# EAGLE design HAP-5xDimmer-3.1 (EAGLE 5.02)
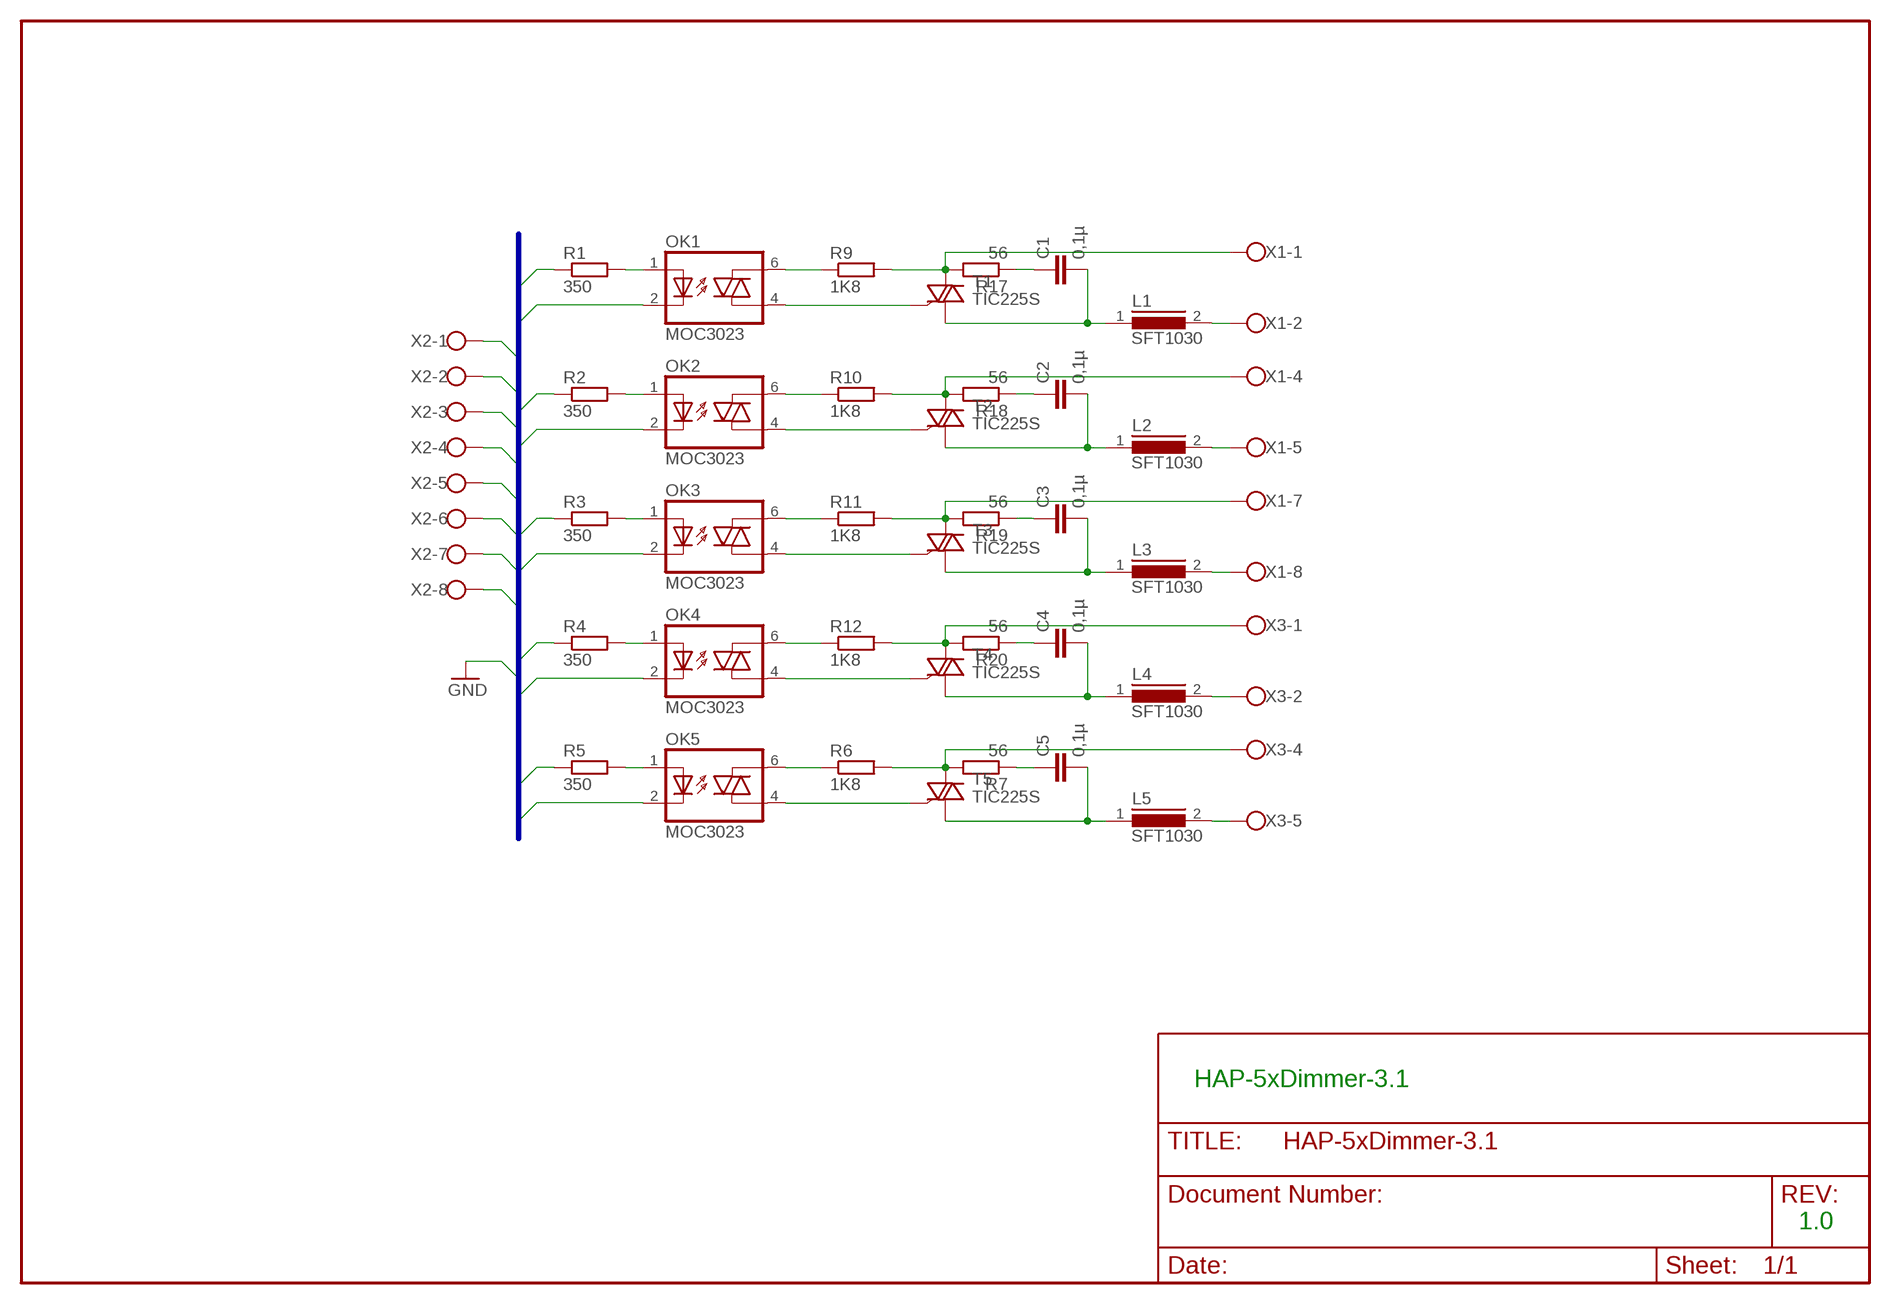
[diagram p0: schematic, sheet 1]

## Parts
C1  0,1µ  C15/8  [C15B8]
C2  0,1µ  C15/8  [C15B8]
C3  0,1µ  C15/8  [C15B8]
C4  0,1µ  C15/8  [C15B8]
C5  0,1µ  C15/8  [C15B8]
L1  SFT1030  [SFT1030]
L2  SFT1030  [SFT1030]
L3  SFT1030  [SFT1030]
L4  SFT1030  [SFT1030]
L5  SFT1030  [SFT1030]
OK1  MOC3023  IL420  [DIL06]
OK2  MOC3023  IL420  [DIL06]
OK3  MOC3023  IL420  [DIL06]
OK4  MOC3023  IL420  [DIL06]
OK5  MOC3023  IL420  [DIL06]
R1  350  R-EU_0204/7  [0204/7]
R2  350  R-EU_0204/7  [0204/7]
R3  350  R-EU_0204/7  [0204/7]
R4  350  R-EU_0204/7  [0204/7]
R5  350  R-EU_0204/7  [0204/7]
R6  1K8  R-EU_0411/3V  [0411V]
R7  56  R-EU_0411/3V  [0411V]
R9  1K8  R-EU_0411/3V  [0411V]
R10  1K8  R-EU_0411/3V  [0411V]
R11  1K8  R-EU_0411/3V  [0411V]
R12  1K8  R-EU_0411/3V  [0411V]
R17  56  R-EU_0411/3V  [0411V]
R18  56  R-EU_0411/3V  [0411V]
R19  56  R-EU_0411/3V  [0411V]
R20  56  R-EU_0411/3V  [0411V]
T1  TIC225S  [TO220DS]
T2  TIC225S  [TO220DS]
T3  TIC225S  [TO220DS]
T4  TIC225S  [TO220DS]
T5  TIC225S  [TO220DS]
X1  W237-08P  [W237-8P]
X2  W237-08P  [W237-8P]
X3  W237-08P  [W237-8P]

## Nets
D0: R1.1 X2.1
D1: R2.1 X2.2
D2: R3.1 X2.3
D3: R4.1 X2.4
D4: R5.1 X2.5
GND: OK1.2(C) OK2.2(C) OK3.2(C) OK4.2(C) OK5.2(C) X2.6 X2.7 X2.8
N$1 [Mains]: C1.2 L1.1 T1.A1
N$2 [Medium]: OK1.4(A1) T1.G
N$3 [Medium]: OK2.4(A1) T2.G
N$4: OK1.1(A) R1.2
N$5 [Medium]: C3.1 R19.1
N$6 [Mains]: L1.2 X1.2
N$7 [Mains]: R9.2 R17.2 T1.A2 X1.1
N$8: OK2.1(A) R2.2
N$9 [Mains]: R10.2 R18.2 T2.A2 X1.4
N$10: OK3.1(A) R3.2
N$11 [Mains]: R11.2 R19.2 T3.A2 X1.7
N$12: OK4.1(A) R4.2
N$13 [Mains]: R12.2 R20.2 T4.A2 X3.1
N$14 [Mains]: L2.2 X1.5
N$15 [Mains]: L3.2 X1.8
N$17 [Mains]: L4.2 X3.2
N$18 [Mains]: R6.2 R7.2 T5.A2 X3.4
N$19 [Mains]: L5.2 X3.5
N$20: OK5.1(A) R5.2
N$21 [Mains]: C2.2 L2.1 T2.A1
N$22 [Medium]: C5.1 R7.1
N$23 [Mains]: C3.2 L3.1 T3.A1
N$24 [Mains]: C5.2 L5.1 T5.A1
N$25 [Mains]: C4.2 L4.1 T4.A1
N$26 [Medium]: OK5.4(A1) T5.G
N$27 [Medium]: OK5.6(A2) R6.1
N$28 [Medium]: OK3.4(A1) T3.G
N$29 [Medium]: OK4.4(A1) T4.G
N$38 [Medium]: OK4.6(A2) R12.1
N$39 [Medium]: OK3.6(A2) R11.1
N$40 [Medium]: OK2.6(A2) R10.1
N$41 [Medium]: OK1.6(A2) R9.1
N$50 [Medium]: C1.1 R17.1
N$51 [Medium]: C2.1 R18.1
N$52 [Medium]: C4.1 R20.1
Unconnected: X1.3 X1.6 X3.3 X3.6 X3.7 X3.8

## Buses
D[0..7],GND

## Notes on the sheet
- HAP-5xDimmer-3.1
- 1.0

## Library data of the parts
C1-C5 = capacitor-wima:C: CAPACITOR naming: grid - package width
L1-L5 = inductors:SFT1030: INDUCTOR
OK1-OK5 = optocoupler:IL420: SIEMENS OPTO COUPLER
R1-R7 R9-R12 R17-R20 = rcl:R-EU_: RESISTOR, European symbol
T1-T5 = triac:TIC225S: TRIAC
X1-X3 = con-wago-508:W237-08P: WAGO SREW CLAMP

## Net classes
1 Mains: width 2.184 mm, clearance 0.508 mm
2 Medium: width 0.813 mm, clearance 0.508 mm

## Board
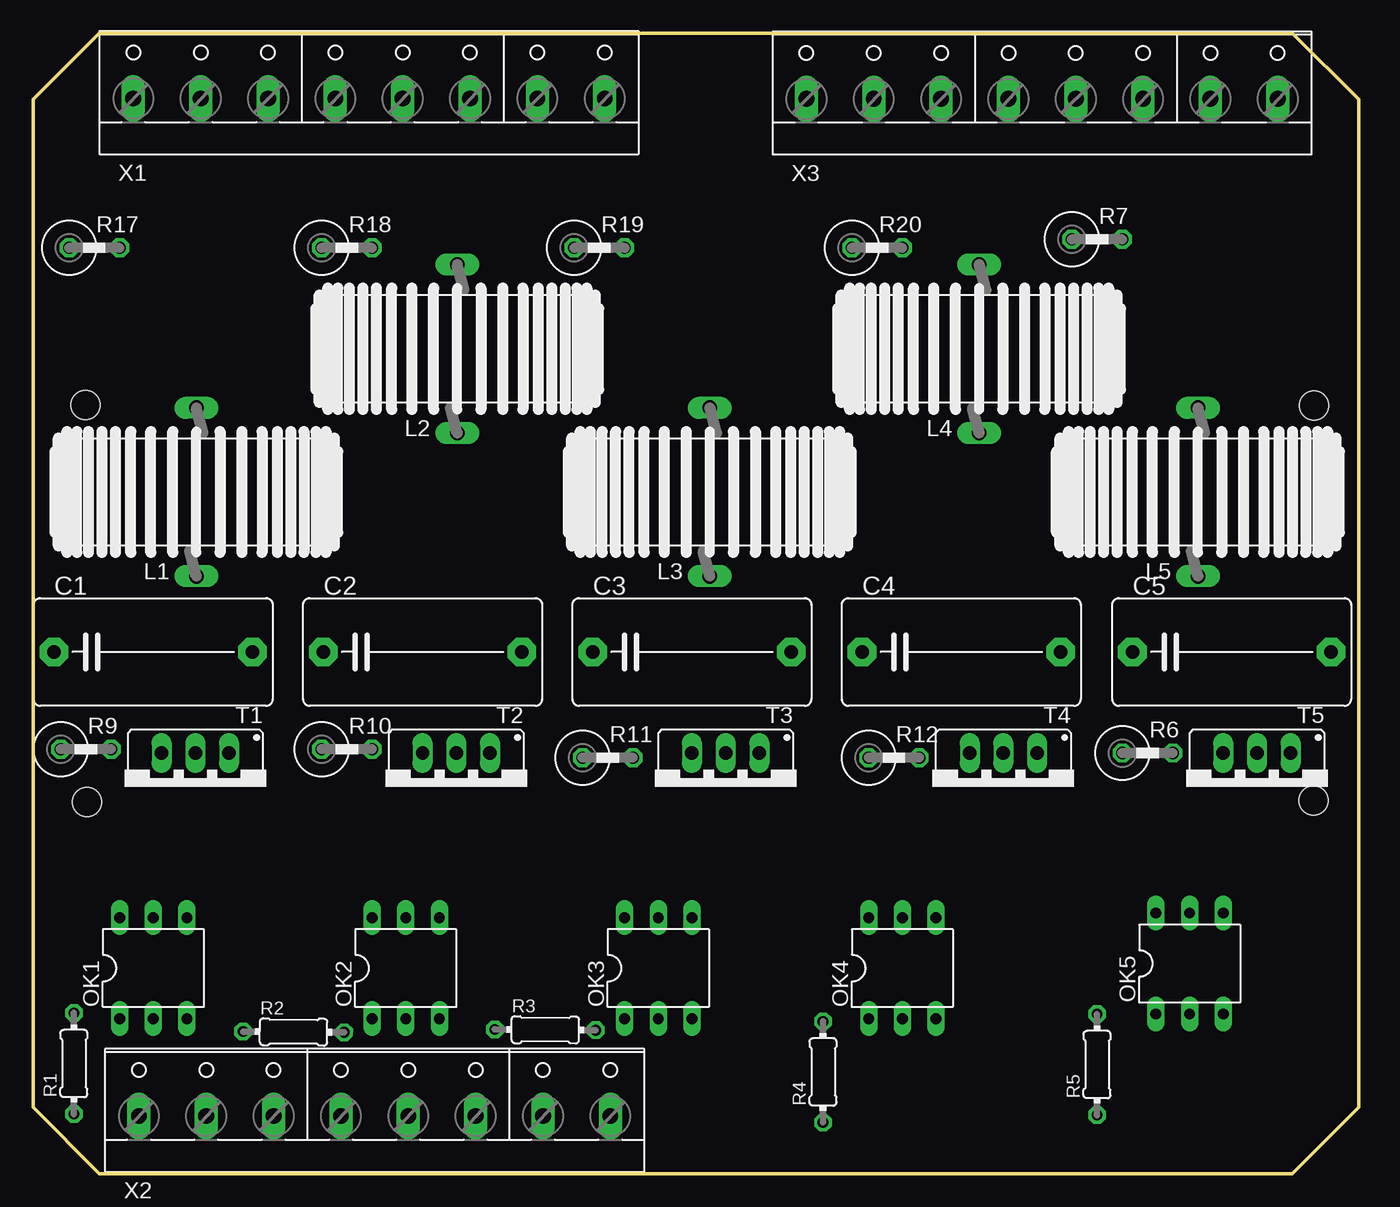
[diagram p1: board, top side]
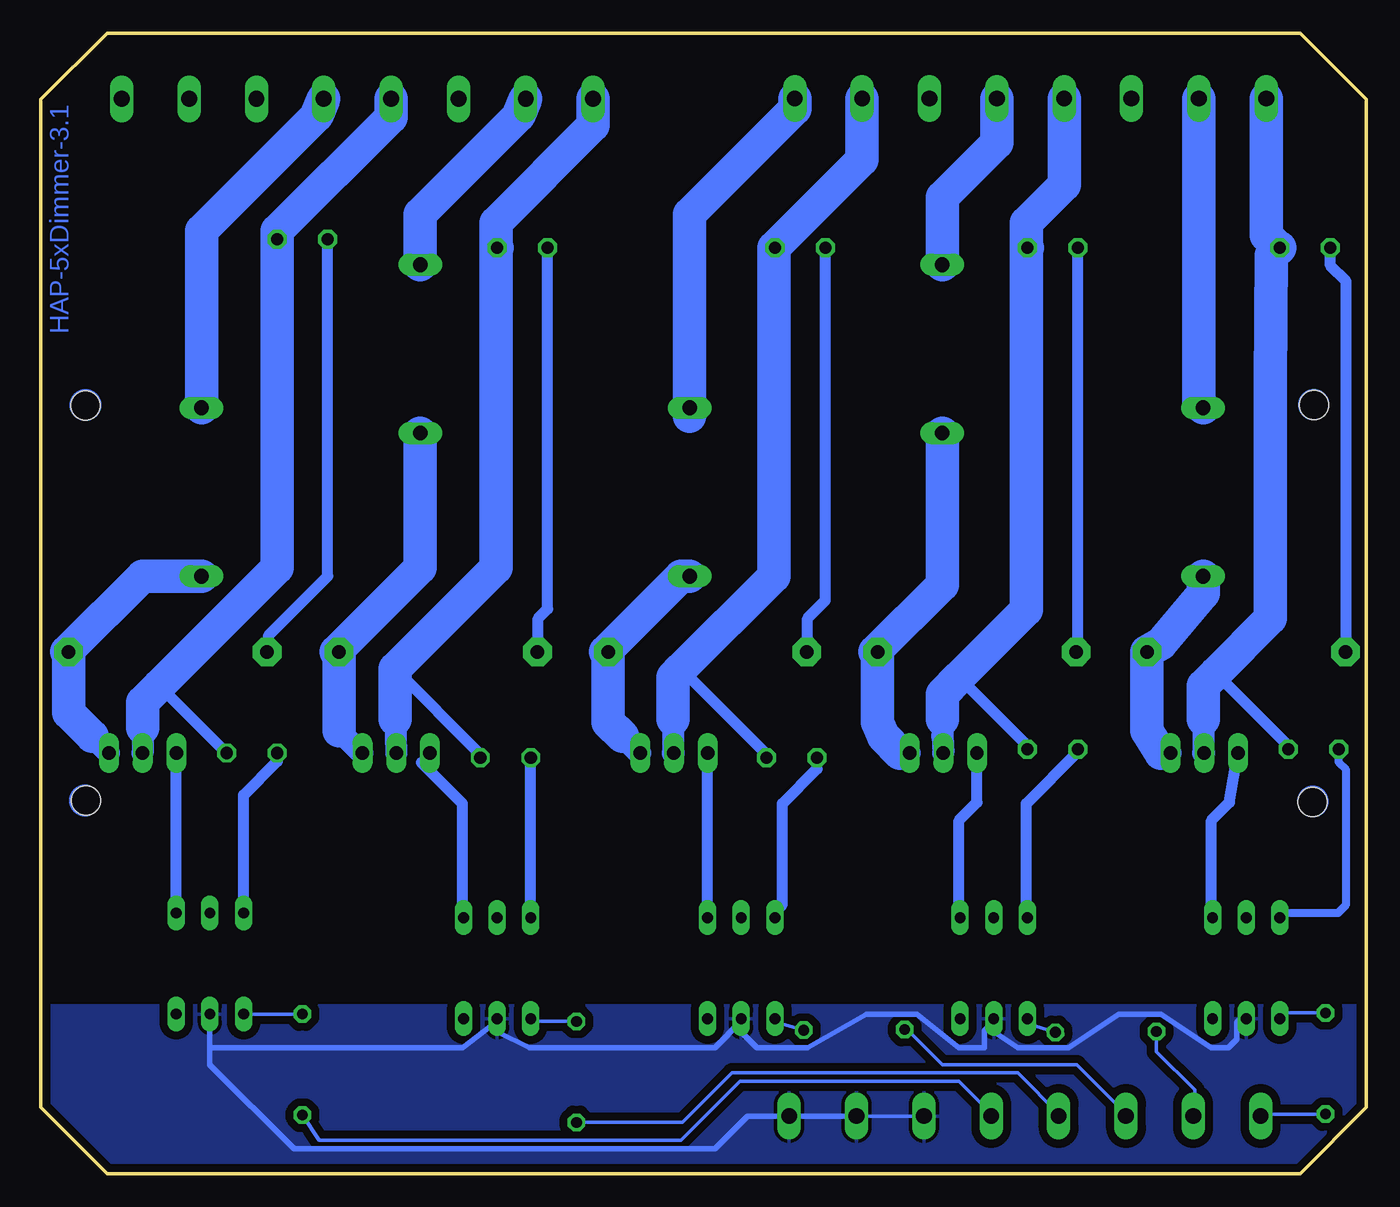
[diagram p2: board, bottom side, seen from below]

Size 100 x 86.01 mm. Coordinates in mm from the lower left corner, seen from the top.
Outline: 5,86.01 0.01,81.01 0,5 5,0 95,0.01
Outline: 95,86.01 100,81.01
Outline: 100,5.01 95,0.01
Outline: 100,81 100,5.01
Outline: 5,86.01 95,86.01
Copper layers (1*16): Top 0.035mm / dielectric 1.5mm / Bottom 0.035mm
Design rules "default": minimum track width 10mil, minimum drill 24mil, track to track 8mil, track to pad 8mil, pad to pad 8mil, via to via 8mil, smd to smd 8mil, copper to edge 10mil, drill to drill 8mil, minimum pad ring 10mil, minimum via ring 8mil, stop-mask expansion 4mil, vias tented up to drill 0mil, thermal gap 10mil
Holes 2.2 mm at 4.07,28.03 96.6,28.14 96.62,57.94 3.96,57.98

### Footprints (pad centres in the part's own frame; a part is rotated, then mirrored left to right if it is on the bottom)
C15B8 = drill 1.016 pad 2.159 octagon: 1 -7.493,0; 2 7.493,0
SFT1030 = drill 1.118 long: 1 -6.35,0; 2 6.35,0
DIL06 = drill 0.813 long: 1 -2.54,-3.81; 2 0,-3.81; 3 2.54,-3.81; 4 2.54,3.81; 5 0,3.81; 6 -2.54,3.81
0204/7 = drill 0.813 octagon: 1 -3.81,0; 2 3.81,0
0411V = drill 0.914 octagon: 1 -2.54,0; 2 1.27,0
TO220DS = drill 1.016 long: A1 -2.54,-2.54; A2 0,-2.54; G 2.54,-2.54
W237-8P = drill 1.194 long: 1 -17.78,-0.635; 2 -12.7,-0.635; 3 -7.62,-0.635; 4 -2.54,-0.635; 5 2.54,-0.635; 6 7.62,-0.635; 7 12.7,-0.635; 8 17.78,-0.635

### Placement (x,y rotation side)
C1  9.06,39.34 0 top
C2  29.38,39.34 0 top
C3  49.7,39.34 0 top
C4  70.02,39.34 0 top
C5  90.42,39.34 0 top
L1  12.32,51.41 90 top
L2  32,62.2 90 top
L3  51.05,51.41 90 top
L4  71.37,62.2 90 top
L5  87.88,51.41 90 top
OK1  9.06,15.5 0 top
OK2  28.11,15.5 0 top
OK3  47.16,15.5 0 top
OK4  65.58,15.5 0 top
OK5  87.25,15.85 0 top
R1  3.08,8.31 90 top
R2  19.65,10.69 359.5 top
R3  38.64,10.85 359.6 top
R4  59.59,7.67 90 top
R5  80.26,8.23 90 top
R6  84.71,31.72 0 top
R7  80.9,70.46 0 top
R9  4.62,32.01 0 top
R10  24.3,32.01 0 top
R11  43.99,31.37 0 top
R12  65.58,31.37 0 top
R17  5.25,69.82 0 top
R18  24.3,69.82 0 top
R19  43.35,69.82 0 top
R20  64.31,69.82 0 top
T1  12.24,29.18 180 top
T2  31.92,29.18 180 top
T3  52.24,29.18 180 top
T4  73.2,29.18 180 top
T5  92.33,29.18 180 top
X1  25.34,81.71 0 top
X2  25.76,4.98 0 top
X3  76.12,81.69 0 top

### Tracks (layer width: path | path; a pad name or v marks a point on that pad's centre or on a via)
D0
  Bottom 0.254: X2.1 7.95,4.34 7.79,4.5 R1.1
D1
  Bottom 0.254: R2.1 15.84,9.21 12.95,6.32 12.95,4.42 13.03,4.34 X2.2
D2
  Bottom 0.254: R3.1 34.83,11.05 32,8.23 21.84,8.23 18.03,4.42 18.11,4.34 X2.3
D3
  Bottom 0.254: R4.1 51.61,3.86 47.88,7.59 26.29,7.59 23.11,4.42 23.19,4.34 X2.4
D4
  Bottom 0.254: R5.1 78.99,2.51 51.69,2.51 47.24,6.96 30.73,6.96 28.19,4.42 28.27,4.34 X2.5
GND
  Bottom 0.254: X2.7 38.43,4.34 38.35,4.42 38.28,4.34 X2.6 | 42.87,4.34 43.43,3.78 43.43,4.42
  Bottom 0.406: 87.25,9.5 OK5.2 | 87.25,9.5 68.2,9.5 65.58,11.48 OK4.2 65.58,10.69 63.12,9.5 49.15,9.5 47.16,11.48 OK3.2 47.16,10.69 45.97,9.5 42.16,9.5 37.72,12.04 33.91,12.04 30.73,9.5 28.83,9.5 28.83,10.77 28.11,11.48 OK2.2 28.11,10.69 26.29,9.5 22.48,9.5 18.67,12.04 15.49,12.04 11.68,9.5 10.41,9.5 9.78,10.13 9.78,11.4 9.06,12.12 OK1.2 | X2.8 43.51,4.34 43.43,4.42 43.36,4.34 42.87,4.34 | 42.87,4.34 X2.7 | 42.87,4.34 46.68,4.34 49.15,1.88 80.9,1.88 87.25,8.23 87.25,9.5
  pour Bottom (isolate 0.61): 0.25,12.67 99.31,12.67 99.95,11.4 99.95,5.05 94.87,-0.03 4.06,-0.03 -0.38,4.42 -0.38,11.4
N$1
  Bottom 1.676: T1.A1 15.49,31.72
  Bottom 2.54: L1.1 12.32,43.79 15.49,39.98 C1.2 16.55,33.42 15.49,31.72
N$2
  Bottom 0.813: T1.G 10.33,27.99 11.68,26.64 11.68,19.66 11.6,19.74 OK1.4
N$3
  Bottom 0.813: 30.65,19.74 30.73,19.66 30.65,19.58 OK2.4 30.65,19.1 30.73,19.02 30.73,26.64 29.38,27.99 T2.G
N$4
  Bottom 0.254: 6.52,12.12 OK1.1 | R1.2 6.52,12.12 | 6.52,12.12 6.6,12.04
N$5
  Bottom 0.61: C3.1 42.16,39.34
  Bottom 0.813: R19.1 40.81,43.23 42.16,41.88 42.16,39.34
N$6
  Bottom 2.54: X1.2 12.64,58.08 L1.2
N$7
  Bottom 0.813: R9.2 5.89,32.28 11.36,37.75
  Bottom 1.676: T1.A2 12.32,31.72 12.32,34.26
  Bottom 2.54: X1.1 7.56,70.78 6.6,69.82 R17.2 7.16,69.27 7.24,59.66 7.24,41.88 11.36,37.75 12.32,36.8 12.32,34.26
N$8
  Bottom 0.254: OK2.1 25.57,11.48 25.65,11.4 25.54,11.29 R2.2
N$9
  Bottom 0.813: R10.2 25.57,32.28 30.73,37.44
  Bottom 1.676: T2.A2 32,32.99 32,34.26
  Bottom 2.54: X1.4 22.8,74.58 25.65,71.73 25.65,69.82 | 25.65,69.82 R18.2 | 25.65,69.82 25.65,42.52 30.73,37.44 32,36.17 32,34.26
N$10
  Bottom 0.254: 44.65,11.45 44.62,11.48 OK3.1 | 44.65,11.45 R3.2 | 44.65,11.45 44.7,11.4
N$11
  Bottom 0.813: R11.2 45.26,31.64 51.69,38.07
  Bottom 1.676: T3.A2 52.32,31.72 52.32,34.26
  Bottom 2.54: 44.7,69.82 R19.2 | X1.7 38.04,76.48 44.7,69.82 | 44.7,69.82 44.7,45.06 51.69,38.07 52.32,37.44 52.32,34.26
N$12
  Bottom 0.254: 63.04,11.48 OK4.1 | R4.2 63.04,11.48 | 63.04,11.48 63.12,11.4
N$13
  Bottom 0.813: R12.2 66.85,31.64 73.28,38.07
  Bottom 1.676: 73.28,34.26 T4.A2
  Bottom 2.54: X3.1 58.34,79.05 65.66,71.73 65.66,69.82 | 65.66,69.82 R20.2 | 65.66,69.82 65.66,45.69 73.28,38.07 73.28,34.26
N$14
  Bottom 2.54: X1.5 27.88,77.75 32,73.63 L2.2
N$15
  Bottom 2.54: X1.8 43.12,80.29 51.05,72.36 L3.2 51.05,57.12
N$17
  Bottom 2.54: X3.2 63.95,79.78 71.37,72.36 L4.2
N$18
  Bottom 0.813: R6.2 91.06,36.8
  Bottom 1.676: 92.33,33.63 T5.A2
  Bottom 2.54: X3.4 73.58,79.68 82.17,71.09 R7.2 82.17,45.69 91.06,36.8 92.33,35.53 92.33,33.63
N$19
  Bottom 2.54: X3.5 79.19,79.78 87.88,71.09 L5.2
N$20
  Bottom 0.254: R5.2 OK5.1
N$21
  Bottom 1.676: T2.A1 35.18,31.72
  Bottom 2.54: L2.1 32,44.42 37.08,39.34 C2.2 36.87,34.05 36.45,32.99 35.18,31.72
N$22
  Bottom 0.813: C5.1 82.8,40.61 78.36,45.06 R7.1
N$23
  Bottom 1.676: T3.A1 54.86,31.72 56.13,32.99
  Bottom 2.54: L3.1 51.69,45.06 57.4,39.34 C3.2 57.19,34.05 56.13,32.99
N$24
  Bottom 1.676: T5.A1 96.14,32.99
  Bottom 2.54: L5.1 92.33,45.06 98.04,39.34 C5.2 97.91,34.77 96.14,32.99
N$25
  Bottom 1.676: T4.A1 75.82,31.72 77.51,33.42
  Bottom 2.54: L4.1 71.37,45.69 77.72,39.34 C4.2 77.51,33.42
N$26
  Bottom 0.813: OK5.4 T5.G
N$27
  Bottom 0.813: R6.1 82.17,31.09 84.71,28.55 OK5.6
N$28
  Bottom 0.813: OK3.4 49.7,19.58 49.78,19.66 49.7,19.74 T3.G
N$29
  Bottom 0.813: T4.G 71.29,31.01 68.2,27.91 68.2,19.66 68.12,19.58 OK4.4
N$38
  Bottom 0.813: OK4.6 63.04,19.58 63.12,19.66 63.04,19.74 R12.1
N$39
  Bottom 0.813: R11.1 41.45,30.53 44.07,27.91 44.07,20.29 44.7,19.66 44.62,19.58 OK3.6
N$40
  Bottom 0.813: R10.1 21.76,31.8 25.65,27.91 25.65,19.02 25.57,19.1 OK2.6
N$41
  Bottom 0.406: 6.6,19.66 6.52,19.58
  Bottom 0.61: R9.1 2.08,31.01 1.52,30.45 1.52,20.29 2.16,19.66 6.6,19.66 | 6.52,19.58 OK1.6
  Bottom 0.813: 6.6,19.66 6.52,19.74
N$50
  Bottom 0.61: 2.16,39.34 2.08,39.9
  Bottom 0.813: R17.1 2.71,68.47 1.52,67.28 1.52,39.98 2.16,39.34 C1.1
N$51
  Bottom 0.61: C2.1 21.84,39.34 21.76,39.42
  Bottom 0.813: 21.76,39.42 R18.1
N$52
  Bottom 0.61: C4.1 62.48,39.34
  Bottom 0.813: R20.1 61.77,42.6 62.48,41.88 62.48,39.34
(copper drawn outside any net)
  shapes: Bottom circle x4

### Text on the board
Bottom: HAP-5xDimmer-3.1